# Altium schematic sheet Module&Connector.SchDoc
size A
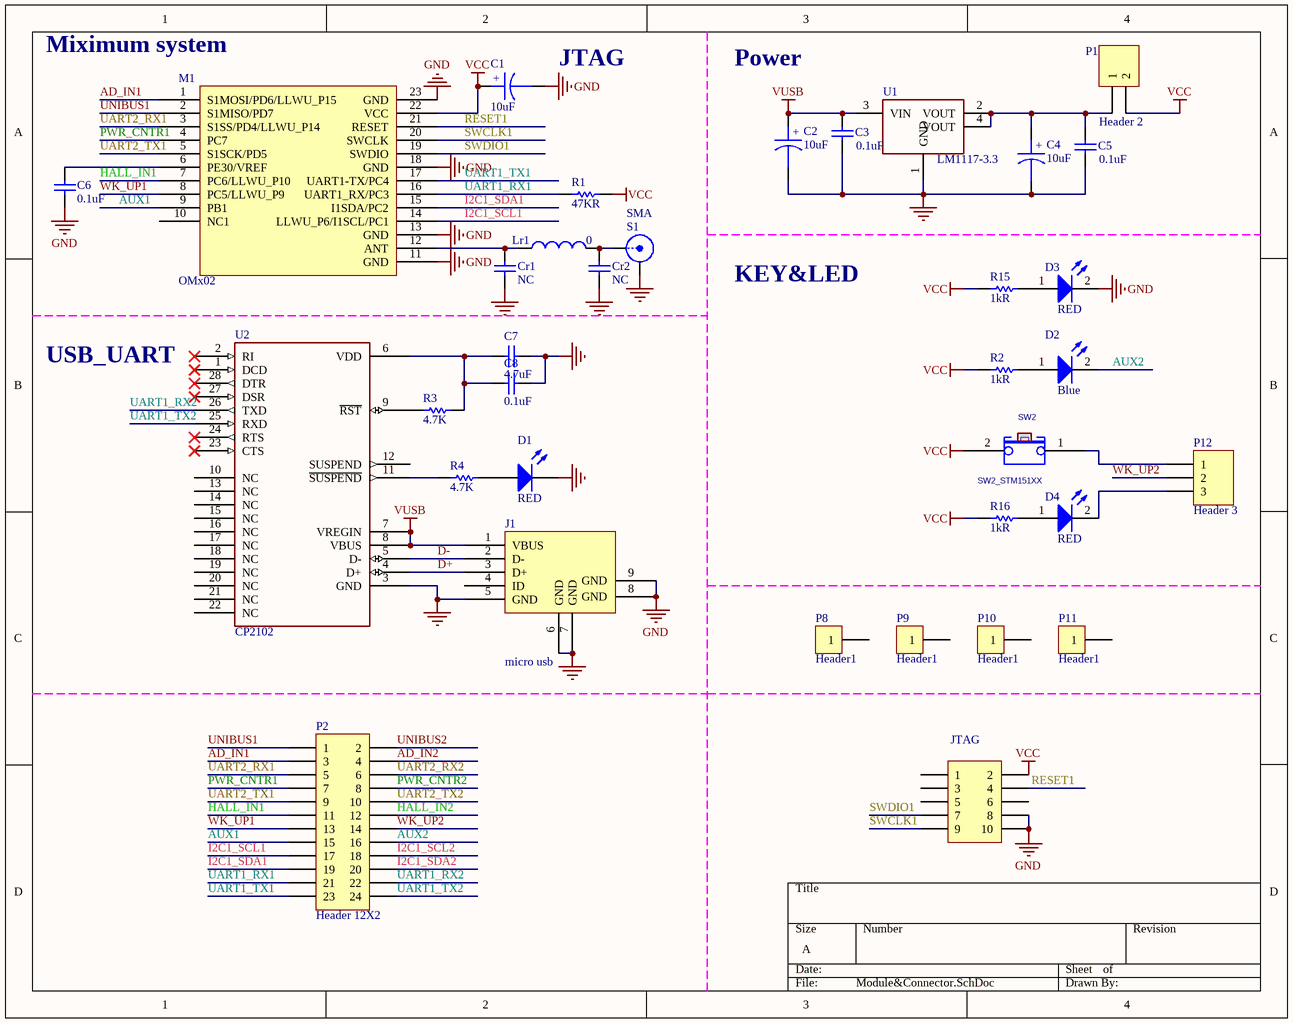
[diagram p0: Module&Connector.SchDoc]

## Parts
C1  10uF  [0805]
C2  10uF  [0805]
C3  0.1uF  [0603RF]
C4  10uF  [0805]
C5  0.1uF  [0603RF]
C6  0.1uF  [0603RF]
C7  4.7uF  [0603RF]
C8  0.1uF  [0603RF]
Cr1  NC  [0603RF]
Cr2  NC  [0603RF]  (no BOM)
D1  RED  [LED0603]
D2  Blue  [LED0603]
D3  RED  [LED0603]
D4  RED  [LED0603]
J1  micro usb  [MICROUSB-D]
JTAG  IDC-10  [JTAG10-MINI]  (value not drawn)
Lr1  0  [0603RF]
M1  OMx02  [OMx02]
P1  Header 2  [HDR1X2]
P2  Header 12X2  [Header2X12]
P8  Header1  [Fix_Hole]
P9  Header1  [Fix_Hole]
P10  Header1  [Fix_Hole]
P11  Header1  [Fix_Hole]
P12  Header 3  [HDR1X3]
R1  47KR  [0603RF]
R2  1kR  [0603RF]
R3  4.7K  [0603RF]
R4  4.7K  [0603RF]
R15  1kR  [0603RF]
R16  1kR  [0603RF]
S1  SMA  [SMA]
SW2  SW2_STM151XX  [SW24*3]
U1  LM1117-3.3  [SOT-223]
U2  CP2102  [QFN28_CP2102]

## Nets
GND: C1.2 C2.2 C3.2 C4.2 C5.2 C6.1 C7.2 C8.2 Cr1.1 Cr2.1 D1.2(K) D3.2(K) J1.5(GND) J1.6(GND) J1.7(GND) J1.8(GND) J1.9(GND) JTAG.8 JTAG.10 M1.11(GND) M1.13(GND) M1.18(GND) M1.23(GND) S1.2(Y) U1.1(GND) U2.0(GND) U2.3(GND)
VCC: C1.1 JTAG.2 M1.22(VCC) P1.2 R1.2 R2.2 R15.2 R16.2 SW2.2(SW2)
VUSB: C2.1 C3.1 J1.1(VBUS) U1.3(VIN) U2.7(VREGIN) U2.8(VBUS)
AD_IN1: M1.1(S1MOSI/PD6/LLWU_P15) P2.3
AD_IN2: P2.4
AUX1: M1.9(PB1) P2.15
AUX2: D2.2(K) P2.16
D+: J1.3(D+) U2.4(D+)
D-: J1.2(D-) U2.5(D-)
HALL_IN1: M1.7(PC6/LLWU_P10) P2.11
HALL_IN2: P2.12
I2C1_SCL1: M1.14(LLWU_P6/I1SCL/PC1) P2.17
I2C1_SCL2: P2.18
I2C1_SDA1: M1.15(I1SDA/PC2) P2.19
I2C1_SDA2: P2.20
PWR_CNTR1: M1.4(PC7) P2.7
PWR_CNTR2: P2.8
RESET1: JTAG.4 M1.21(RESET)
SWCLK1: JTAG.9 M1.20(SWCLK)
SWDIO1: JTAG.7 M1.19(SWDIO)
UART1_RX1: M1.16(UART1_RX/PC3) P2.21 R1.1
UART1_RX2: P2.22 U2.26(TXD)
UART1_TX1: M1.17(UART1-TX/PC4) P2.23
UART1_TX2: P2.24 U2.25(RXD)
UART2_RX1: M1.3(S1SS/PD4/LLWU_P14) P2.5
UART2_RX2: P2.6
UART2_TX1: M1.5(S1SCK/PD5) P2.9
UART2_TX2: P2.10
UNIBUS1: M1.2(S1MISO/PD7) P2.1
UNIBUS2: P2.2
WK_UP1: M1.8(PC5/LLWU_P9) P2.13
WK_UP2: P2.14 P12.2
NetC4_1: C4.1 C5.1 P1.1 U1.2(VOUT) U1.4(VOUT)
NetC6_2: C6.2 M1.6(PE30/VREF)
NetC7_1: C7.1 C8.1 R3.2 U2.6(VDD)
NetCr1_2: Cr1.2 Lr1.1 M1.12(ANT)
NetCr2_2: Cr2.2 Lr1.2 S1.1(X)
NetD1_1: D1.1(A) R4.2
NetD2_1: D2.1(A) R2.1
NetD3_1: D3.1(A) R15.1
NetD4_1: D4.1(A) R16.1
NetD4_2: D4.2(K) P12.3
NetP12_1: P12.1 SW2.1(SW1)
NetR3_1: R3.1 U2.9(~{RST})
NetR4_1: R4.1 U2.11(~{SUSPEND})

Not connected (* = marked no-connect by the designer): J1 4(ID); JTAG 1 3 5 6; M1 10(NC1); P8 1; P9 1; P10 1; P11 1; U2 1(DCD)* 2(RI)* 10(NC) 12(SUSPEND) 13(NC) 14(NC) 15(NC) 16(NC) 17(NC) 18(NC) 19(NC) 20(NC) 21(NC) 22(NC) 23(CTS)* 24(RTS)* 27(DSR)* 28(DTR)*

## Notes on the sheet
- (near M1) Miximum system
- (near C1) JTAG
- Power
- KEY&LED
- USB_UART
- (in symbol CAPACITOR POL) +

## Library data of the parts
C1 C2 C4 = CAPACITOR POL: Capacitor
C3 C5 = Cap: Capacitor; Value: 10nF; Published: 8-Jun-2000; Revision: July-2002: Re-released for DXP Platform.; Publisher: Altium Limited
C6-C8 Cr1 Cr2 = Cap Semi: Capacitor (Semiconductor SIM Model); Published: 8-Jun-2000; LatestRevisionDate: 29-May-2009; LatestRevisionNote: IPC-7351 Footprint Added.; PackageReference: C1206; Publisher: Altium Limited; PackageDescription: Chip Capacitor
  C6 C8: Value: 0.1uF
  C7: Value: 4.7uF
  Cr1 Cr2: Value: NC
D1-D4 = LED2: Typical RED, GREEN, YELLOW, AMBER GaAs LED; Published: 8-Jun-2000; Publisher: Altium Limited
  D1: LatestRevisionDate: 17-Jul-2002; LatestRevisionNote: Re-released for DXP Platform.; PackageVersion: Feb-2002; PackageReference: 3.2X1.6X1.1; PackageDescription: SM LED; 2 Flat Leads
  D2-D4: Revision: July-2002: Re-released for DXP Platform.
J1 = micro usb: 同GDI401的USB接口一致
JTAG = Header 5X2: 双排插针2.54mm; LatestRevisionDate: 17-Jul-2002; LatestRevisionNote: Re-released for DXP Platform.; Publisher: Altium Limited
Lr1 = Inductor: Code_IEC: 1005; Published: 8-Jun-2000; LatestRevisionDate: 29-May-2009; LatestRevisionNote: IPC-7351 Footprint Added.; PackageReference: 0402-A; Publisher: Altium Limited; PackageDescription: Chip Inductor; Code_JEITA: 0402; Value: 0
P1 = Header 2: Header, 2-Pin; LatestRevisionDate: 17-Jul-2002; LatestRevisionNote: Re-released for DXP Platform.; Publisher: Altium Limited
P2 = Header 12X2: Header, 12-Pin, Dual row; LatestRevisionDate: 17-Jul-2002; LatestRevisionNote: Re-released for DXP Platform.; Publisher: Altium Limited
P12 = Header 3: Header, 3-Pin; LatestRevisionDate: 17-Jul-2002; LatestRevisionNote: Re-released for DXP Platform.; Publisher: Altium Limited
R1-R4 R15 R16 = Res Semi: Semiconductor Resistor; Published: 8-Jun-2000; LatestRevisionDate: 17-Jul-2002; LatestRevisionNote: Re-released for DXP Platform.; PackageReference: AXIAL-0.5; Publisher: Altium Limited; PackageDescription: Axial Device, Thru-Hole; 2 Leads; 0.5 in Pin Spacing
  R1: Value: 47KR
  R2 R15 R16: Value: 1kR
  R3 R4: Value: 4.7K
S1 = SMB: SMB Straight Connector; LatestRevisionDate: 17-Jul-2002; LatestRevisionNote: Re-released for DXP Platform.; Publisher: Altium Limited
SW2 = SW2_STM151XX: 轻触开关3x4x2,http://www.szlcsc.com/product/details_27383.html; CLASS: IC; AGILE_PN: 510-76958; MFG_NAME01: E SWITCH; MFG_PN01: TL1015BF160QG; CAD_APPROVED: Yes; ROHS: Yes; HEIGHT: 2MM
U1 = LM1117: LM1117 5V转3.3V电源芯片
U2 = CP2102: USB转UART芯片